# EAGLE design AD7685_v1 (EAGLE 6.5.0)
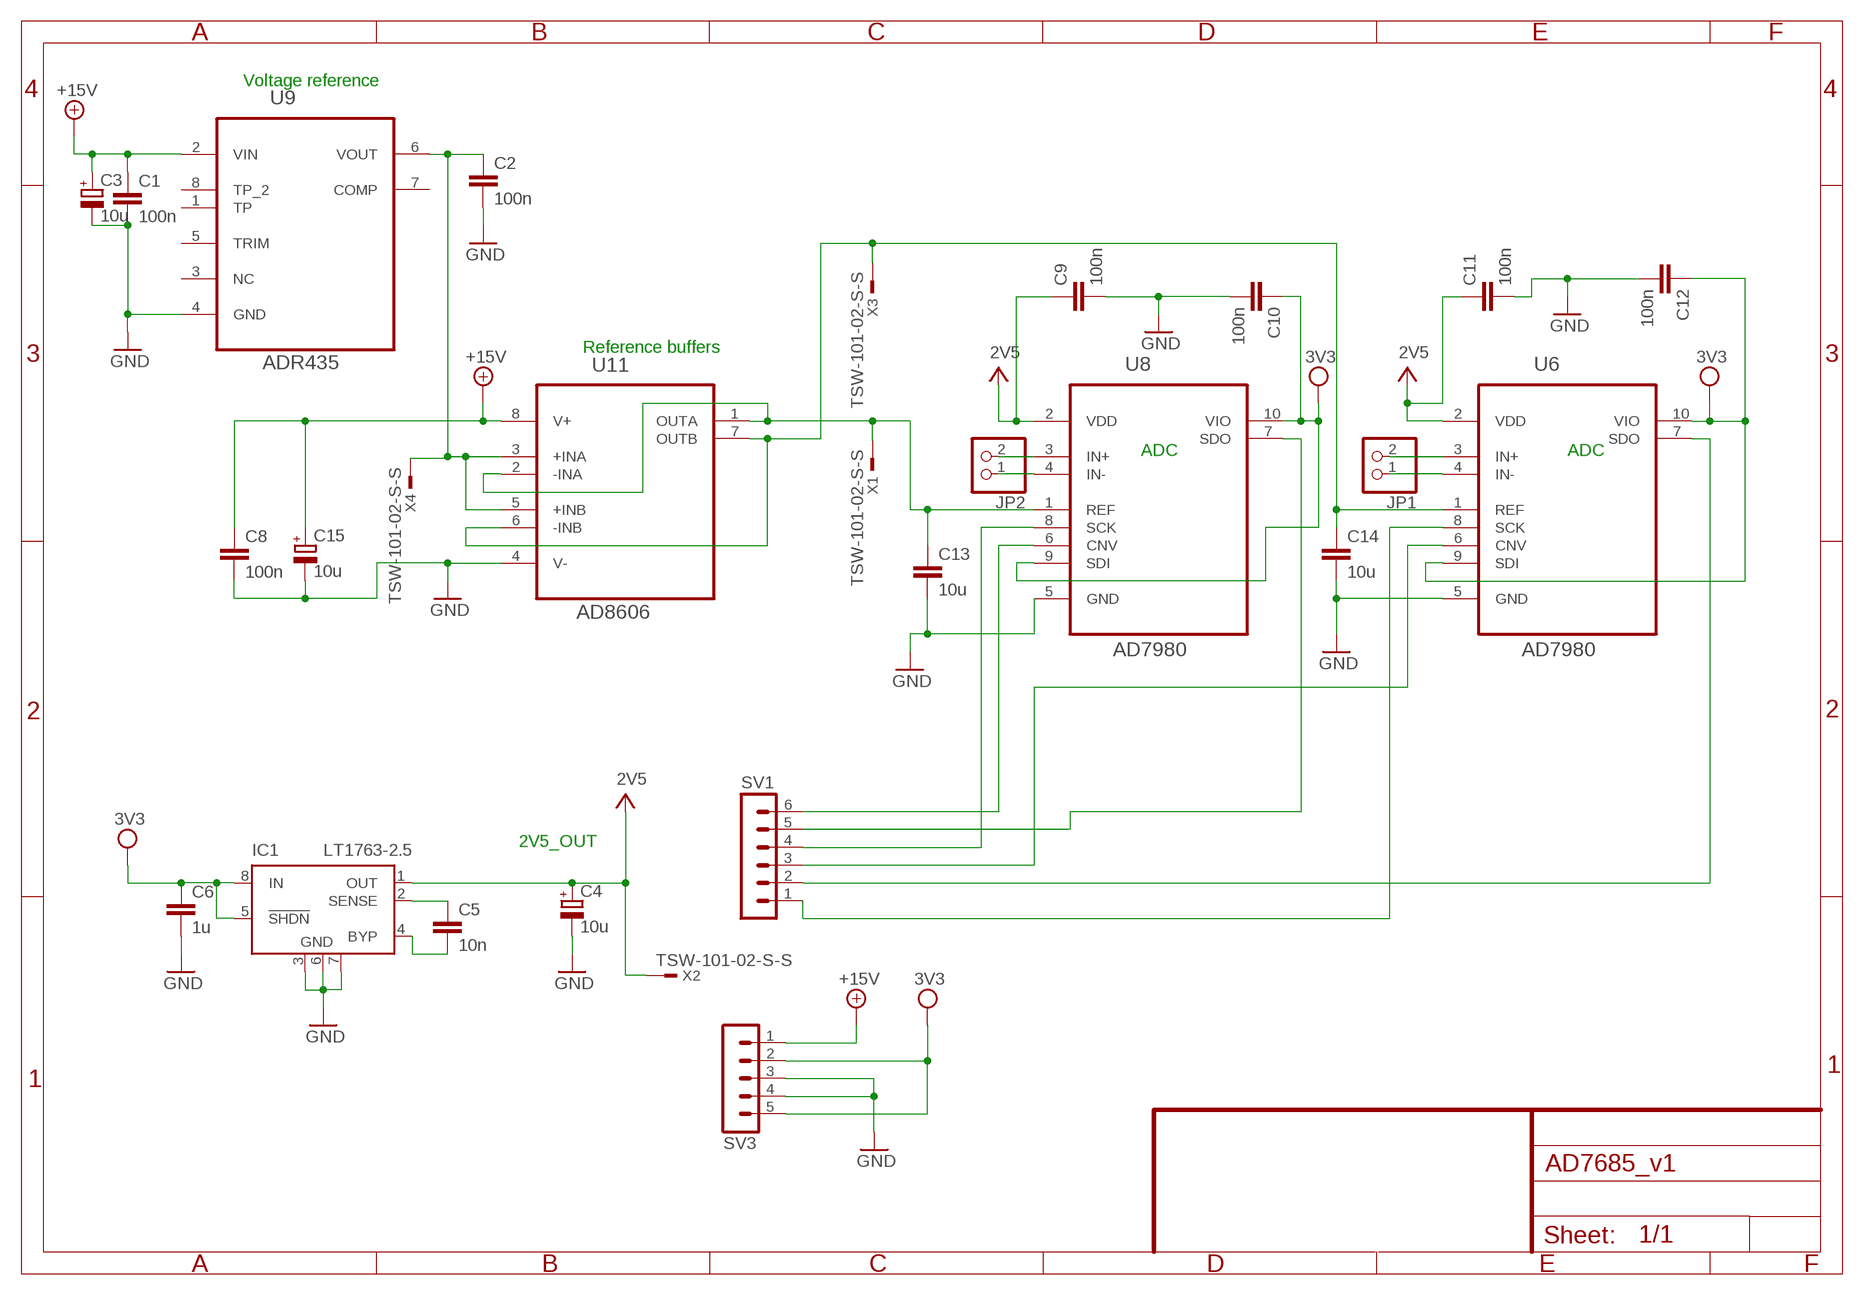
[diagram p0: schematic, sheet 1]

## Parts
C1  100n  C-EUC0603K  [C0603K]
C2  100n  C-EUC0603K  [C0603K]
C3  10u  CPOL-EUSMCA  [SMC_A]
C4  10u  CPOL-EUSMCA  [SMC_A]
C5  10n  C-EUC0603K  [C0603K]
C6  1u  C-EUC0603K  [C0603K]
C8  100n  C-EUC0603K  [C0603K]
C9  100n  C-EUC0603K  [C0603K]
C10  100n  C-EUC0603K  [C0603K]
C11  100n  C-EUC0603K  [C0603K]
C12  100n  C-EUC0603K  [C0603K]
C13  10u  C-EUC0603K  [C0603K]
C14  10u  C-EUC0603K  [C0603K]
C15  10u  CPOL-EUSMCA  [SMC_A]
IC1  LT1763-2.5  LT1763CS8-2.5  [SOIC8]
JP1  PINHD-1X2  [1X02]
JP2  PINHD-1X2  [1X02]
SV1  MA06-1  [MA06-1]
SV3  MA05-1  [MA05-1]
U6  AD7980  AD7980BRMZ  [SOP50P490X110-10N]
U8  AD7980  AD7980BRMZ  [SOP50P490X110-10N]
U9  ADR435  ADR435ARMZ  [SOP65P490X110-8N]
U11  AD8606  AD8606ARMZ-R7  [SOP65P490X110-8N]
X1  TSW-101-02-S-S  [TSW-101-02-S-S]
X2  TSW-101-02-S-S  [TSW-101-02-S-S]
X3  TSW-101-02-S-S  [TSW-101-02-S-S]
X4  TSW-101-02-S-S  [TSW-101-02-S-S]

## Nets
+15V: C1.1 C3.+ C8.1 C15.+ SV3.1 U9.2(VIN) U11.8(V+)
GND: C1.2 C2.2 C3.- C4.- C6.2 C8.2 C9.2 C10.2 C11.2 C12.2 C13.2 C14.2 C15.- IC1.3(GND) IC1.6(GND) IC1.7(GND) SV3.3 SV3.4 U6.5(GND) U8.5(GND) U9.4(GND) U11.4(V-)
N$1: JP2.2 U8.3(IN+)
N$2: JP2.1 U8.4(IN-)
N$3: SV1.4 U8.8(SCK)
N$4: C5.2 IC1.4(BYP)
N$5: C5.1 IC1.2(SENSE)
N$6: JP1.2 U6.3(IN+)
N$7: C2.1 U9.6(VOUT) U11.3(+INA) U11.5(+INB) X4.1
N$8: SV1.6 U8.6(CNV)
N$9: C14.1 U6.1(REF) U11.6(-INB) U11.7(OUTB) X3.1
N$10: JP1.1 U6.4(IN-)
N$11: SV1.5 U8.7(SDO)
N$12: C13.1 U8.1(REF) U11.1(OUTA) U11.2(-INA) X1.1
N$13: SV1.1 U6.8(SCK)
N$15: SV1.3 U6.6(CNV)
N$17: SV1.2 U6.7(SDO)
V+: C4.+ C9.1 C11.1 IC1.1(OUT) U6.2(VDD) U8.2(VDD) X2.1 ; supply symbol labelled 2V5
VDD: C6.1 C10.1 C12.1 IC1.5(!SHDN) IC1.8(IN) SV3.2 SV3.5 U6.9(SDI) U6.10(VIO) U8.9(SDI) U8.10(VIO) ; supply symbol labelled 3V3
Unconnected: U9.1(TP) U9.3(NC) U9.5(TRIM) U9.8(TP_2)

## Notes on the sheet
- Voltage reference
- Reference buffers
- ADC | ADC
- 2V5_OUT

## Power pins joined to a net without a drawn wire
COMP: U9.7(COMP)

## Library data of the parts
C1 C2 C5 C6 C8-C14 = rcl:C-EU: CAPACITOR, European symbol
C3 C4 C15 = rcl:CPOL-EU: POLARIZED CAPACITOR, European symbol
IC1 = linear-technology:LT1763CS8: 500mA, Low Noise, LDO Micropower Regulators Source: http://cds.linear.com/docs/Datasheet/1763ff.pdf; MPN: LT1763CS8-2.5; OC_FARNELL: 1273616; OC_NEWARK: 57M6051
JP1 JP2 = pinhead:PINHD-1X2: PIN HEADER
SV1 = con-lstb:MA06-1: PIN HEADER; OC_FARNELL: unknown; OC_NEWARK: unknown
SV3 = con-lstb:MA05-1: PIN HEADER; OC_FARNELL: unknown; OC_NEWARK: unknown
U6 U8 = Analog Devices_By_element14_Batch_1:AD7980BRMZ: ADC; MPN: AD7980BRMZ; OC_FARNELL: 1607234; OC_NEWARK: 54M6762; PACKAGE: MSOP-10; SUPPLIER: ANALOG DEVICES
U9 = Analog Devices_By_element14_Batch_1:ADR435ARMZ: Ultralow Noise XFET Voltage References with Current Sink and Source Capability; MPN: ADR435ARMZ; OC_FARNELL: 1699602; OC_NEWARK: 59K2822; PACKAGE: MSOP-8; SUPPLIER: ANALOG DEVICES
U11 = Analog Devices_By_element14_Batch_1:AD8606ARMZ-R7: Input/Output Operational Amplifiers; MPN: AD8606ARMZ-R7; OC_FARNELL: -; OC_NEWARK: 26R2476; PACKAGE: MSOP-8; SUPPLIER: Analog Devices
X1-X4 = con-samtec:TSW-101-02-S-S: THROUGH-HOLE .025" SQ POST HEADER Source: Samtec TSW.pdf; OC_FARNELL: unknown; OC_NEWARK: unknown

## Net classes
0 default: width 0.178 mm, drill 0.381 mm, clearance 0.178 mm
1 Power: width 0.813 mm, drill 0.381 mm, clearance 0.178 mm

## Board
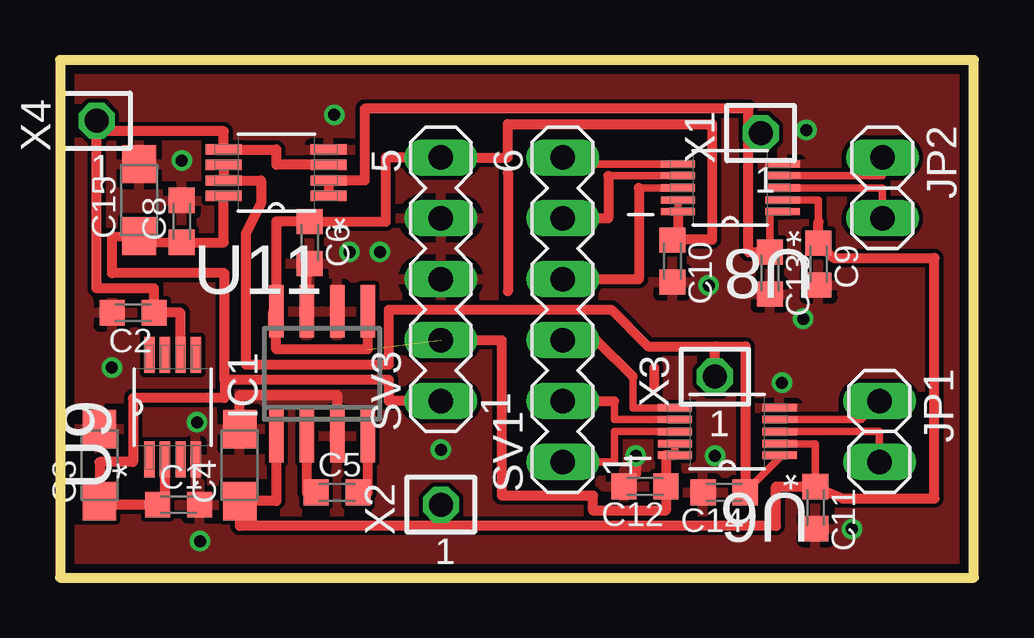
[diagram p1: board, top side]
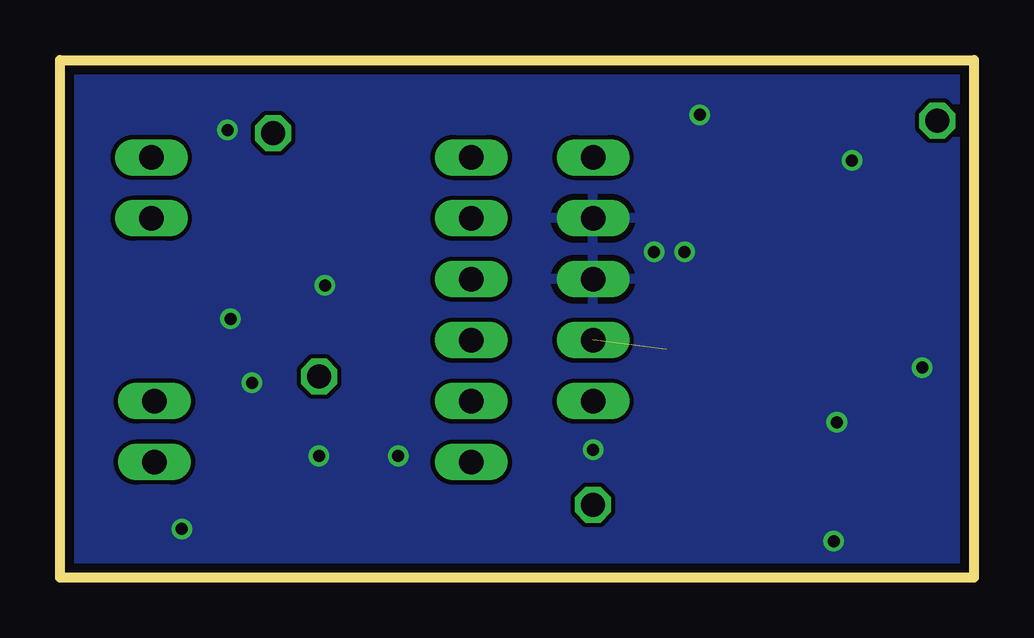
[diagram p2: board, bottom side, seen from below]

Size 38.1 x 21.59 mm. Coordinates in mm from the lower left corner, seen from the top.
Outline: 0,0 38.1,0 38.1,21.59 0,21.59 0,0
Copper layers (1*16): Top 0.0356mm / dielectric 1.5011mm / Bottom 0.0356mm
Design rules "LaenPCBOrder": minimum track width 6mil, minimum drill 13mil, track to track 6mil, track to pad 6mil, pad to pad 6mil, via to via 6mil, smd to smd 6mil, copper to edge 15mil, drill to drill 6mil, minimum pad ring 7mil, minimum via ring 7mil, stop-mask expansion 3mil, vias tented up to drill 0mil, thermal gap 10mil

### Footprints (pad centres in the part's own frame; a part is rotated, then mirrored left to right if it is on the bottom)
C0603K = smd 1.05 x 1.08: 1 -0.875,0; 2 0.875,0
SMC_A = smd 1.6 x 1.4: + -1.5,0; - 1.5,0
SOIC8 = smd 0.6 x 2.2: 1 -1.905,-2.6; 2 -0.635,-2.6; 3 0.635,-2.6; 4 1.905,-2.6; 5 1.905,2.6; 6 0.635,2.6; 7 -0.635,2.6; 8 -1.905,2.6
1X02 = drill 1.016 long: 1 -1.27,0; 2 1.27,0
MA06-1 = drill 1.016 long: 1 -6.35,0; 2 -3.81,0; 3 -1.27,0; 4 1.27,0; 5 3.81,0; 6 6.35,0
MA05-1 = drill 1.016 long: 1 -5.08,0; 2 -2.54,0; 3 0,0; 4 2.54,0; 5 5.08,0
SOP50P490X110-10N = smd 1.422 x 0.305: 1 -2.184,0.991; 2 -2.184,0.508; 3 -2.184,0; 4 -2.184,-0.508; 5 -2.184,-0.991; 6 2.184,-0.991; 7 2.184,-0.508; 8 2.184,0; 9 2.184,0.508; 10 2.184,0.991
SOP65P490X110-8N = smd 1.499 x 0.432: 1 -2.184,0.965; 2 -2.184,0.33; 3 -2.184,-0.33; 4 -2.184,-0.965; 5 2.184,-0.965; 6 2.184,-0.33; 7 2.184,0.33; 8 2.184,0.965
TSW-101-02-S-S = drill 1 pad 1.5 octagon: 1 0,0

### Placement (x,y rotation side)
C1  4.95,3.05 0 top
C2  3.05,11.05 180 top
C3  1.65,4.7 90 top
C4  7.49,4.7 90 top
C5  11.56,3.56 0 top
C6  10.41,13.97 270 top
C8  5.08,14.86 90 top
C9  31.62,13.08 270 top
C10  25.53,13.21 270 top
C11  31.5,2.92 270 top
C12  24.38,3.81 180 top
C13  29.59,12.7 270 top
C14  27.69,3.56 180 top
C15  3.3,15.75 90 top
IC1  10.92,8.51 0 top
JP1  34.16,6.1 270 top
JP2  34.29,16.26 270 top
SV1  20.95,11.18 90 top
SV3  15.88,12.45 90 top
U6  27.81,6.1 180 top
U8  27.94,16.26 180 top
U9  4.7,7.11 90 top
U11  9.02,16.89 180 top
X1  29.21,18.54 0 top
X2  15.88,3.05 0 top
X3  27.3,8.38 0 top
X4  1.52,19.05 0 top

### Tracks (layer width: path | path; a pad name or v marks a point on that pad's centre or on a via)
+15V
  Top 0.406: 4.37,3.43 C1.1 | C1.1 1.92,3.05 C3.+ 1.65,4.83 3.05,4.83 3.05,7.49 6.86,7.49 6.86,8.26 | 6.86,8.26 6.86,12.7 2.16,12.7 2.16,14.2 C15.+ 3.3,13.96 C8.1 6.83,13.98 U11.8 | SV3.1 13.72,7.37 13.72,8.26 6.86,8.26 | U9.2 4.37,3.05 C1.1
GND  (via drill 0.5)
  Top 0.406: IC1.7 10.29,12.59 C6.2 | C4.- 7.49,7.62 11.56,7.62 IC1.3 | v24,5.08 24,4.3 C12.2
  other vias: 11.43,19.3 5.08,17.4 5.71,6.48 30.1,8.13 27.05,12.19 27.3,5.08 15.88,5.33 2.16,8.76 5.84,1.52 33.02,2.03 31.11,18.67 12.06,13.59 13.34,13.59 30.99,10.79
  pour Bottom: -1.91,22.99 39.88,22.99 40.01,-2.16 -1.91,-2.16
  pour Top: -2.92,24 40.89,23.62 40.77,-2.79 -2.67,-2.79
N$1
  Top 0.305: U8.3 34.29,16.26 JP2.2
N$2
  Top 0.305: U8.4 34.29,16.76 JP2.1
N$3
  Top 0.305: U8.8 24.13,16.26
  Top 0.406: 24.13,16.26 24.13,12.45 SV1.4
N$4
  Top 0.406: IC1.4 12.83,3.56 C5.2
N$5
  Top 0.406: IC1.2 10.29,3.56 C5.1
N$6
  Top 0.305: U6.3 34.16,6.1 JP1.2
N$7
  Top 0.406: 1.52,18.62 1.52,12.06 3.92,12.06 C2.1 5.03,11.05 U9.6 | U11.3 9.02,17.22 9.02,17.86 U11.5 6.83,18.62 1.52,18.62 | X4.1 1.52,18.62
N$8
  Top 0.305: U8.6 20.95,17.25
  Top 0.406: 20.95,17.25 SV1.6
N$9
  Top 0.305: U6.1 30,4.99 C14.1
  Top 0.406: U11.6 U11.7 8.38,16.56 8.38,15.62 7.75,14.35 7.75,8.89 13.72,8.89 13.72,11.18 22.99,11.18 24.51,9.65 27.3,9.65 | 27.3,9.65 28.57,9.65 28.57,3.56 C14.1 | X3.1 27.3,9.65
N$10
  Top 0.305: U6.4 33.4,6.6 JP1.1
N$11
  Top 0.305: U8.7 22.86,16.76
  Top 0.406: 22.86,16.76 22.86,14.99 SV1.5
N$12
  Top 0.305: U8.1 29.59,15.27 C13.1
  Top 0.406: U11.1 U11.2 12.7,16.56 12.7,19.56 28.7,19.56 28.7,18.54 | 28.7,18.54 28.7,13.57 C13.1 | X1.1 28.7,18.54
N$13
  Top 0.305: U6.8 23.11,6.1 23.11,4.83 SV1.1
N$14
  Top 0.406: 18.67,16.89 18.67,11.94
N$15
  Top 0.305: U6.6 23.88,7.09 23.88,8.38
  Top 0.406: SV1.3 22.35,9.91 23.88,8.38
N$16
  Top 0.406: 24.77,8.76 24.77,7.87
N$17
  Top 0.305: U6.7 23.11,6.6 23.11,7.37
  Top 0.406: SV1.2 23.11,7.37
V+
  Top 0.305: U8.2 31.62,15.75 31.62,14.85 | U6.2 31.5,5.59 C11.1
  Top 0.406: 31.62,14.85 C9.1 32.24,13.34 36.45,13.34 36.45,3.3 32.62,3.3 C11.1 | 15.88,2.16 29.84,2.16 29.84,3.8 C11.1 | 15.88,2.16 7.49,2.16 C4.+ 9.02,3.2 IC1.1 | C11.1 31.62,3.56 | X2.1 15.88,2.16
VDD  (1 unrouted)
  Top 0.305: U6.10 U6.9 | U8.9 U8.10
  Top 0.406: 12.83,11.94 IC1.5 12.83,9.53 9.02,9.53 9.02,10.41 8.89,10.41 8.89,11.11 IC1.8 9.02,14.86 C6.1 13.59,14.85 13.59,17.53 SV3.5 18.67,17.53 18.67,18.92 27.18,18.92 27.18,14.1 25.53,14.1 C10.1 25.76,14.08 U8.10 | U6.10 25.26,5.11 C12.1 25.26,2.79 22.23,2.79 22.23,3.43 18.41,3.43 18.41,9.91 SV3.2